# EAGLE design ac (EAGLE 5.08)
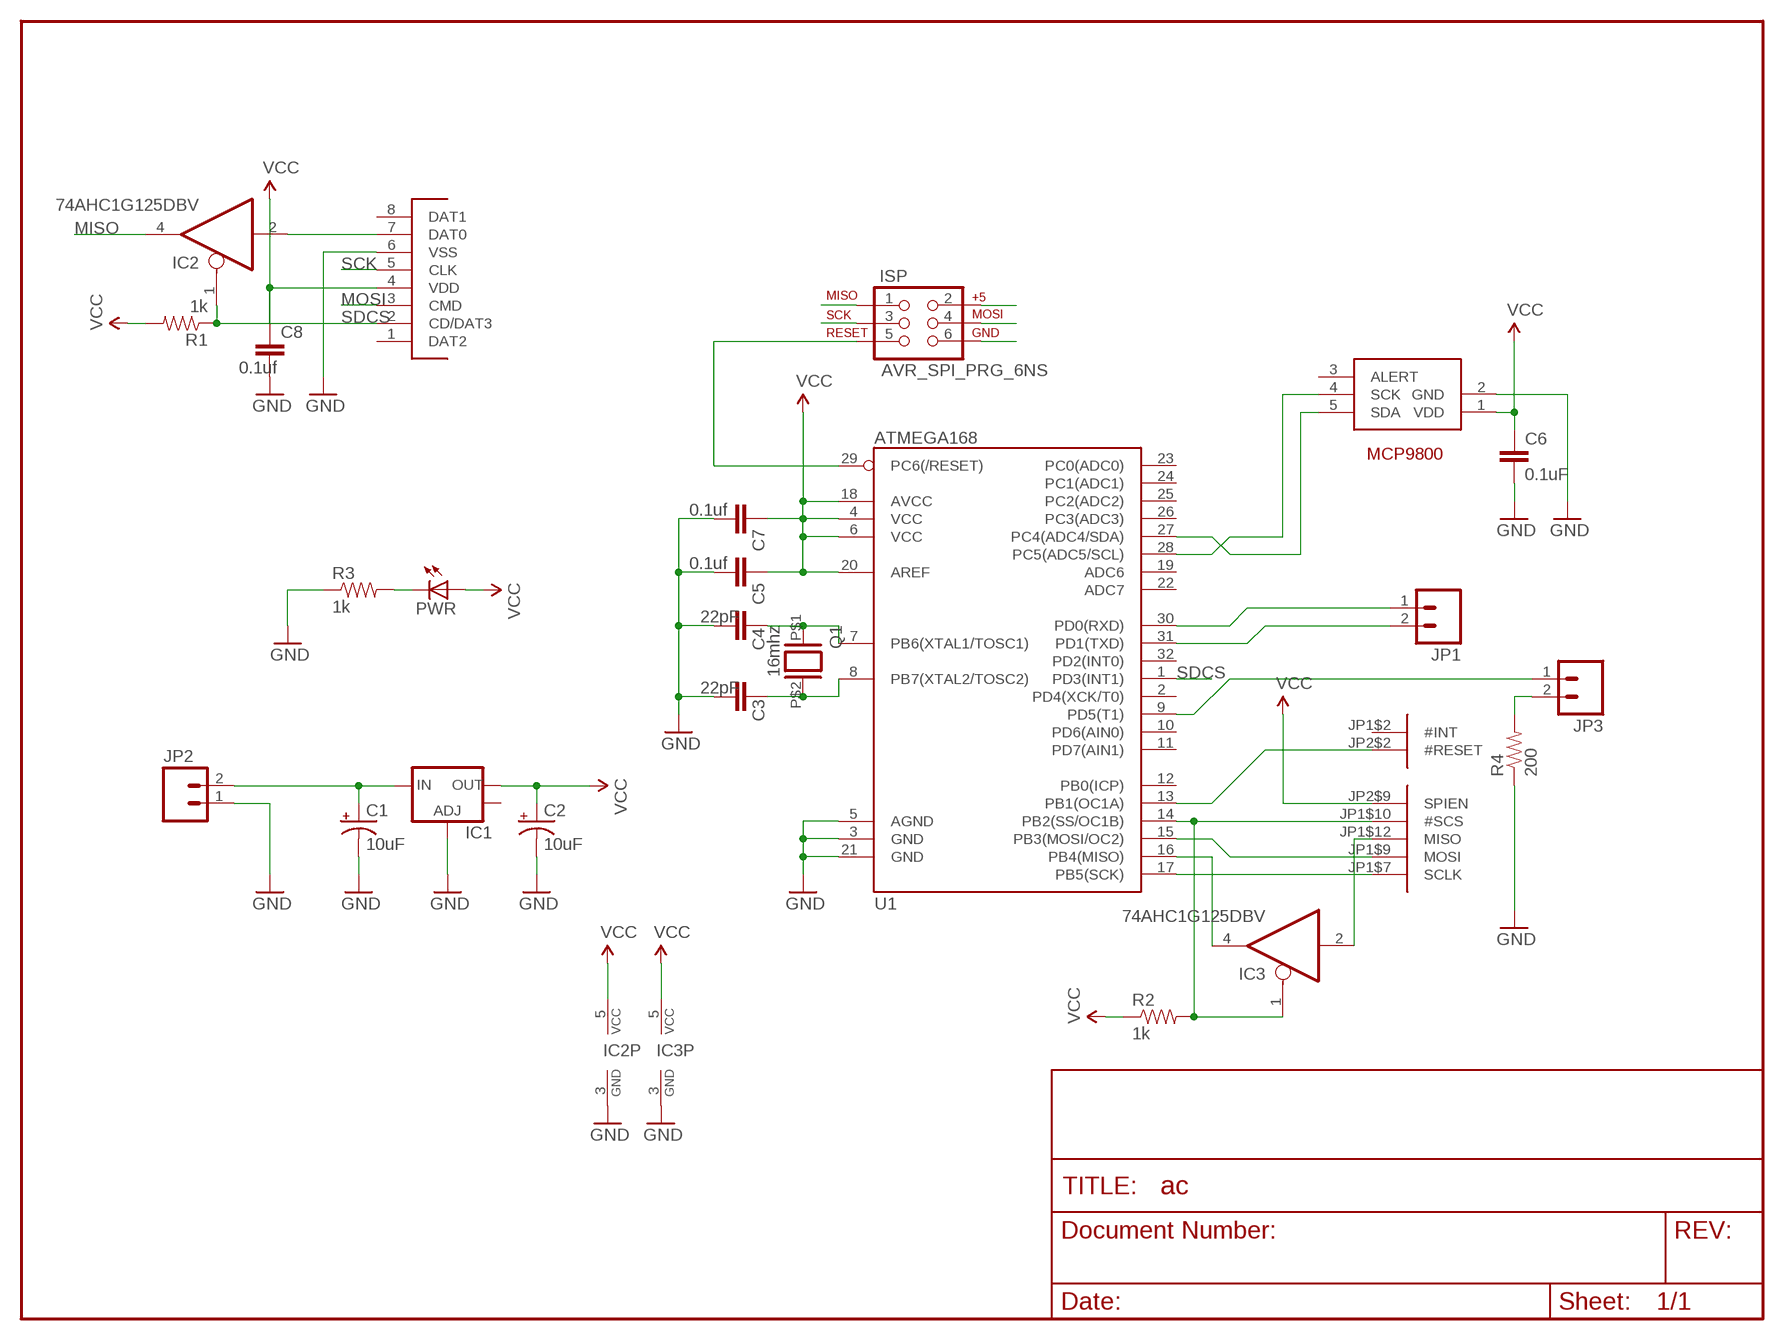
[diagram p0: schematic, sheet 1]

## Parts
C1  10uF  CAP_POL1206  [EIA3216]
C2  10uF  CAP_POL1206  [EIA3216]
C3  22pF  CAP0805  [0805]
C4  22pF  CAP0805  [0805]
C5  0.1uf  CAP0805  [0805]
C6  0.1uF  CAP0805  [0805]
C7  0.1uf  CAP0805  [0805]
C8  0.1uf  CAP0805  [0805]
IC1  V_REG_LM1117SOT223  [SOT223]
IC2  74AHC1G125DBV  [SOT23-5]
IC3  74AHC1G125DBV  [SOT23-5]
ISP  AVR_SPI_PRG_6NS  [2X3-NS]
JP1  M02PTH  [1X02]
JP2  M02PTH  [1X02]
JP3  M02PTH  [1X02]
PWR  LED1206  [LED-1206]
Q1  16mhz  ECX-64A  [ECX-64A]
R1  1k  RESISTOR  [0805]
R2  1k  RESISTOR  [0805]
R3  1k  RESISTOR  [0805]
R4  200  RESISTOR  [0805]
U1  ATMEGA168  [TQFP32-08]
U2  MCP9800  [SOT23-5]
U$1  WIZ810MJ  WIZ810MJSMT  [WIZ810MJ-SMT]
U$2  HRS-DM3D  [HRS-DM3D]

## Nets
+3V3: C2.A(+) C5.1 C6.1 C7.1 C8.1 IC1.2(OUT) IC2.5(VCC) IC3.5(VCC) ISP.2 PWR.A R1.2 R2.1 U1.4(VCC) U1.6(VCC) U1.18(AVCC) U1.20(AREF) U2.1(VDD) U$1.JP2$9(SPIEN) U$2.4(VDD) ; supply symbol labelled VCC
GND: C1.C(-) C2.C(-) C3.1 C4.1 C5.2 C6.2 C7.2 C8.2 IC1.1(ADJ) IC2.3(GND) IC3.3(GND) ISP.6 JP2.1 R3.1 R4.1 U1.3(GND) U1.5(AGND) U1.21(GND) U2.2(GND) U$2.6(VSS)
IR-OUT: JP3.1 U1.9(PD5(T1))
MISO: IC2.4(O) IC3.4(O) ISP.1 U1.16(PB4(MISO))
MOSI: ISP.4 U1.15(PB3(MOSI/OC2)) U$1.JP1$9(MOSI) U$2.3(CMD)
N$1: C1.A(+) IC1.3(IN) JP2.2
N$2: C4.2 Q1.P$1 U1.7(PB6(XTAL1/TOSC1))
N$3: ISP.5 U1.29(PC6(/RESET))
N$4: C3.2 Q1.P$2 U1.8(PB7(XTAL2/TOSC2))
N$5: PWR.C R3.2
N$6: JP3.2 R4.2
N$7: U1.28(PC5(ADC5/SCL)) U2.4(SCK)
N$8: U1.27(PC4(ADC4/SDA)) U2.5(SDA)
N$9: IC2.2(I) U$2.7(DAT0)
N$10: IC3.2(I) U$1.JP1$12(MISO)
RESET: U1.13(PB1(OC1A)) U$1.JP2$2(#RESET)
RX: JP1.1 U1.30(PD0(RXD))
SCK: ISP.3 U1.17(PB5(SCK)) U$1.JP1$7(SCLK) U$2.5(CLK)
SDCS: IC2.1(OE) R1.1 U1.1(PD3(INT1)) U$2.2(CD/DAT3)
TX: JP1.2 U1.31(PD1(TXD))
WIZNET_CS: IC3.1(OE) R2.2 U1.14(PB2(SS/OC1B)) U$1.JP1$10(#SCS)
Unconnected: IC1.4(OUT) U1.2(PD4(XCK/T0)) U1.10(PD6(AIN0)) U1.11(PD7(AIN1)) U1.12(PB0(ICP)) U1.19(ADC6) U1.22(ADC7) U1.23(PC0(ADC0)) U1.24(PC1(ADC1)) U1.25(PC2(ADC2)) U1.26(PC3(ADC3)) U1.32(PD2(INT0)) U2.3(ALERT) U$1.JP1$2(#INT) U$1.JP2$6(#COLLED) U$1.JP2$8(#TXLED) U$1.JP2$10(#RXLED) U$1.JP2$11(#FDXLED) U$1.JP2$12(#LINKLED) U$2.1(DAT2) U$2.8(DAT1)

## Power pins joined to a net without a drawn wire
+3V3: U$1.JP1$1(+3V3) U$1.JP2$24(+3V3)
GND: U$1.JP1$8(GND) U$1.JP1$13(GND) U$1.JP1$24(GND) U$1.JP2$1(GND) U$1.JP2$4(GND) U$1.JP2$7(GND) U$1.JP2$13(GND) U$1.JP2$14(GND) U$1.JP2$23(GND)

## Library data of the parts
C1 C2 = SparkFun:CAP_POL: Capacitor Polarized These are standard SMD and PTH capacitors. Normally 10uF, 47uF, and 100uF in electrolytic and tantalum varieties. Always verify the external diameter of the through hole cap, it varies with capacity, voltage, and manufacturer. The EIA devices should be standard.
C3-C8 = SparkFun:CAP: Capacitor Standard 0603 ceramic capacitor, and 0.1" leaded capacitor.
IC1 = SparkFun:V_REG_LM1117: Voltage Regulator LM1117 Standard adjustable voltage regulator but in SMD form. Spark Fun Electronics SKU : COM-00595
IC2 IC3 = 74xx-little-us:74*1G125: Single Bus Buffer Gate with 3-State Output
ISP = SparkFun:AVR_SPI_PRG_6: AVR ISP 6 Pin This is the reduced ISP connector for AVR programming. Common on Arduino. This footprint will take up less PCB space and can be used with a 10-pin to 6-pin adapter such as SKU: BOB-08508
JP1-JP3 = SparkFun:M02: Header 2 Standard 2-pin 0.1" header. Use with straight break away headers (SKU : PRT-00116), right angle break away headers (PRT-00553), swiss pins (PRT-00743), machine pins (PRT-00117), and female headers (PRT-00115). Molex polarized connector foot print use with SKU : PRT-08233 with associated crimp pins and housings.
PWR = SparkFun:LED: LEDs Standard schematic elements and footprints for 5mm, 3mm, 1206, and 0603 sized LEDs. 5mm - Spark Fun Electronics SKU : COM-00529 (and others)
Q1 = ac:ECX-64A
R1-R4 = SparkFun:RESISTOR: Resistor Basic schematic elements and footprints for 0603, 1206, and PTH 1/10th watt (small) resistors.
U1 = SparkFun:ATMEGA168
U2 = ac:MCP9800: MCP8500 Digital temperature sensors converts temperatures between -55°C and +125°C to a digital word. They provide an accuracy of ±1°C (max.) from -10°C to +85°C.
U$1 = ac:WIZ810MJ: WIZ810MJ (W5100) WIZ810MJ is a network module that includes the W5100 (TCP/IP hardwired chip, include PHY), MAG-JACK (RJ45 with X?FMR) with other glue logics. It can be used as a component and no effort is required to interface W5100 and Transformer.
U$2 = ac:HRS-DM3D

## Board
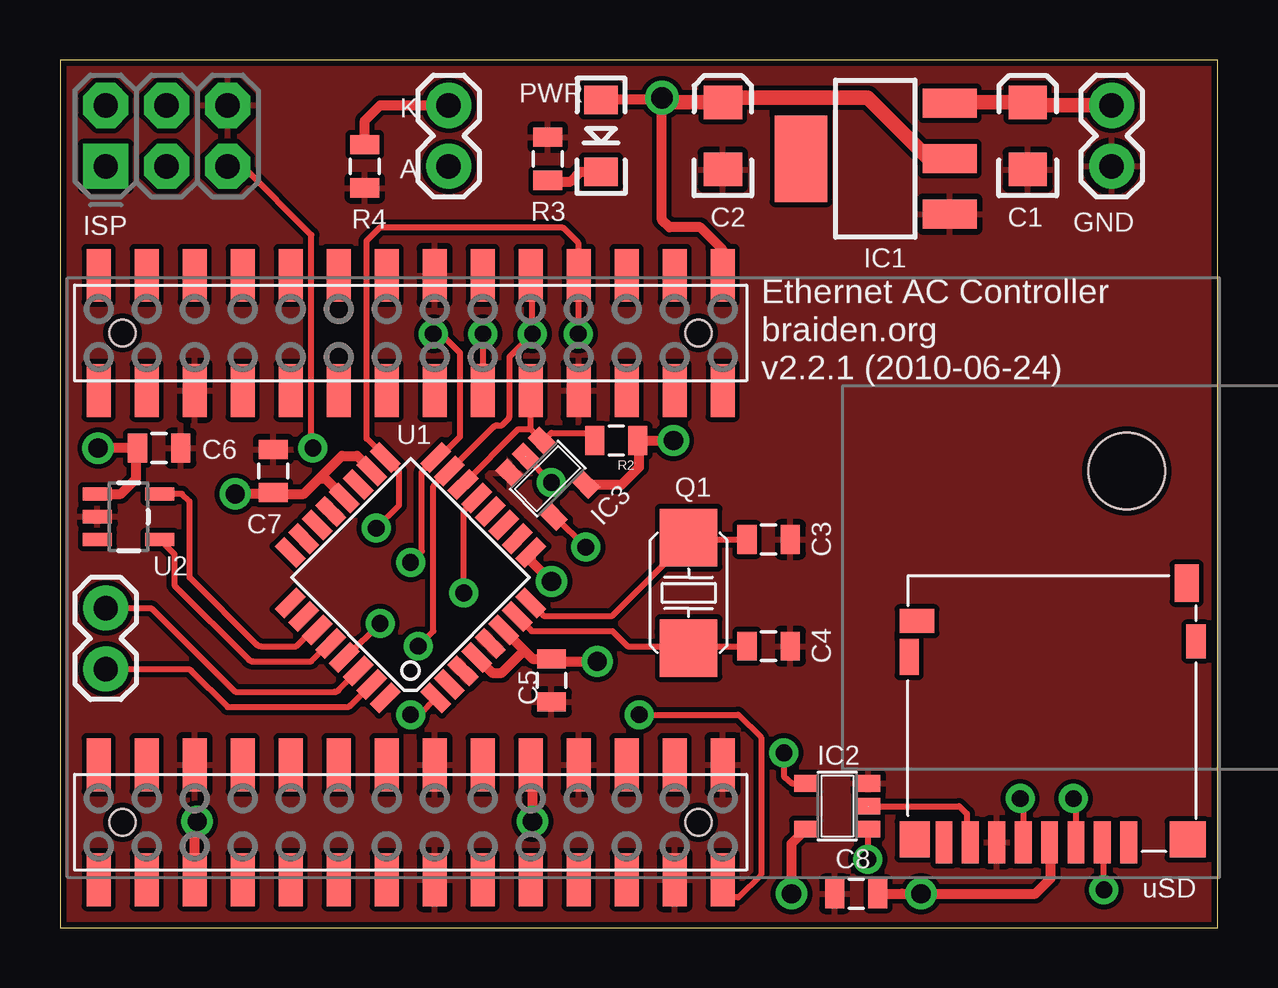
[diagram p1: board, top side]
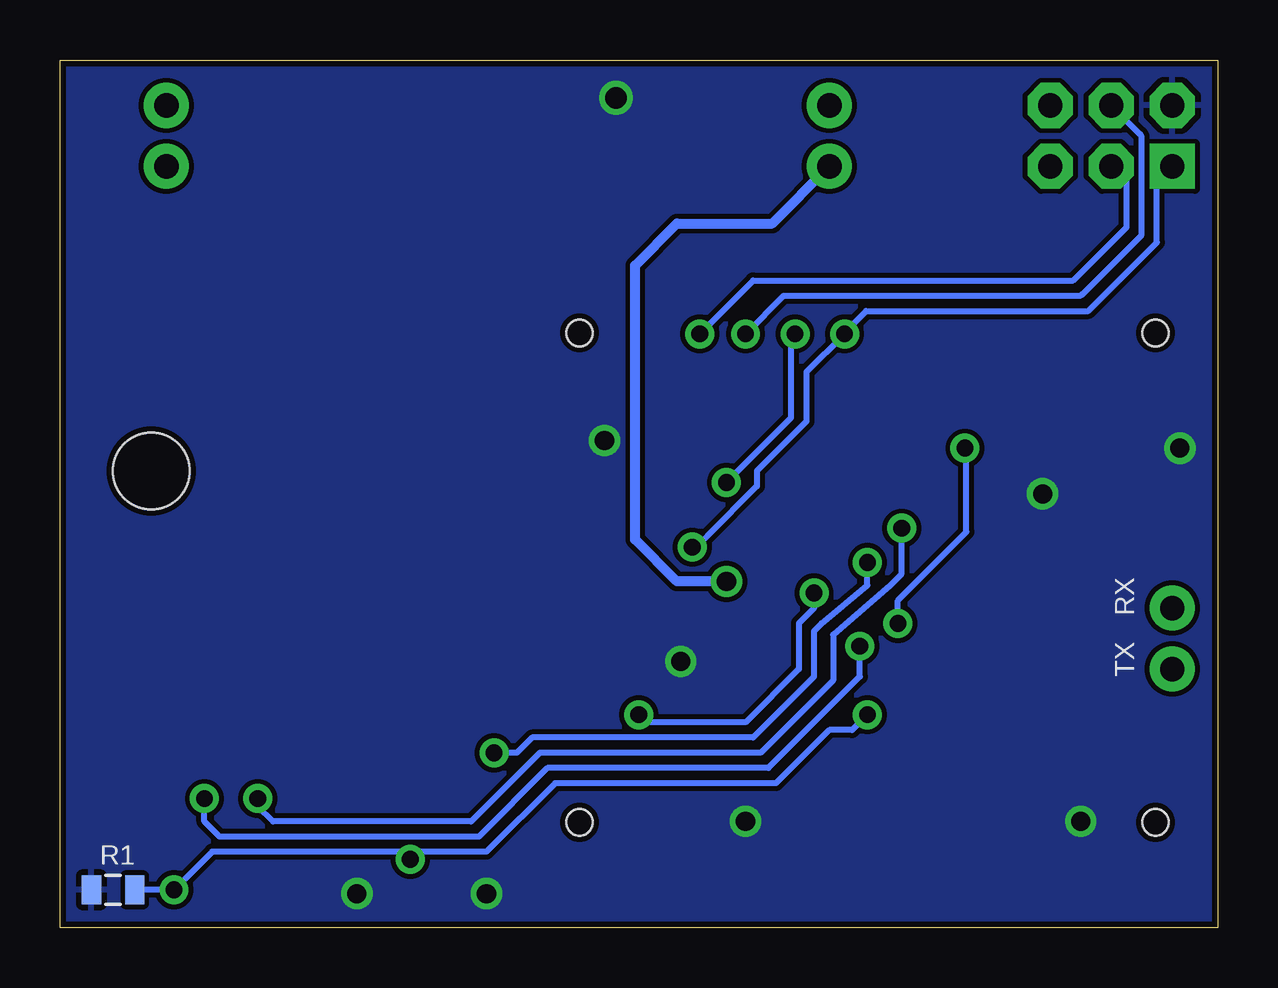
[diagram p2: board, bottom side, seen from below]

Size 48.25 x 36.19 mm. Coordinates in mm from the lower left corner, seen from the top.
Outline: 0,0 48.25,0 48.25,36.19 0,36.19 0,0
Copper layers (1*16): Top 0.035mm / dielectric 1.5mm / Bottom 0.035mm
Design rules "batchpbc": minimum track width 8mil, minimum drill 20mil, track to track 8mil, track to pad 8mil, pad to pad 8mil, via to via 8mil, smd to smd 8mil, copper to edge 10mil, drill to drill 8mil, minimum pad ring 12mil, minimum via ring 10mil, stop-mask expansion 4mil, vias tented up to drill 25mil, thermal gap 10mil
Holes 3.2 mm at 44.45,19.05

### Footprints (pad centres in the part's own frame; a part is rotated, then mirrored left to right if it is on the bottom)
EIA3216 = smd 1.4 x 1.6: A 1.4,0; C -1.4,0
0805 = smd 0.8 x 1.2: 1 -0.9,0; 2 0.9,0
SOT223 = smd 1.219 x 2.235: 1 -2.311,-3.099; 2 0,-3.099; 3 2.311,-3.099 | smd 3.6 x 2.2: 4 0,3.099
SOT23-5 = smd 0.69 x 0.99: 1 -0.95,-1.29; 2 0,-1.29; 3 0.95,-1.29; 4 0.95,1.3; 5 -0.95,1.3
2X3-NS = drill 1.016 pad 1.88 square: 1 -2.54,-1.27 | drill 1.016 pad 1.88 octagon: 2 -2.54,1.27; 3 0,-1.27; 4 0,1.27; 5 2.54,-1.27; 6 2.54,1.27
1X02 = drill 1.016 pad 1.88 round: 1 0,0; 2 2.54,0
LED-1206 = smd 1.2 x 1.4: A -1.5,0; C 1.5,0
ECX-64A = smd 2.4 x 2.4: P$1 -2.3,0; P$2 2.3,0
TQFP32-08 = smd 1.27 x 0.559: 1 -4.293,2.8; 2 -4.293,2; 3 -4.293,1.2; 4 -4.293,0.4; 5 -4.293,-0.4; 6 -4.293,-1.2; 7 -4.293,-2; 8 -4.293,-2.8; 17 4.293,-2.8; 18 4.293,-2; 19 4.293,-1.2; 20 4.293,-0.4; 21 4.293,0.4; 22 4.293,1.2; 23 4.293,2; 24 4.293,2.8 | smd 0.559 x 1.27: 9 -2.8,-4.293; 10 -2,-4.293; 11 -1.2,-4.293; 12 -0.4,-4.293; 13 0.4,-4.293; 14 1.2,-4.293; 15 2,-4.293; 16 2.8,-4.293; 25 2.8,4.293; 26 2,4.293; 27 1.2,4.293; 28 0.4,4.293; 29 -0.4,4.293; 30 -1.2,4.293; 31 -2,4.293; 32 -2.8,4.293
SOT23-5' = smd 0.55 x 1.2: 1 -0.95,-1.3; 2 0,-1.3; 3 0.95,-1.3; 4 0.95,1.3; 5 -0.95,1.3
WIZ810MJ-SMT = smd 1 x 2.2: JP1$1 13,12.6; JP1$2 13,7.8; JP1$3 11,12.6; JP1$4 11,7.8; JP1$5 9,12.6; JP1$6 9,7.8; JP1$7 7,12.6; JP1$8 7,7.8; JP1$9 5,12.6; JP1$10 5,7.8; JP1$11 3,12.6; JP1$12 3,7.8; JP1$13 1,12.6; JP1$14 1,7.8; JP1$15 -1,12.6; JP1$16 -1,7.8; JP1$17 -3,12.6; JP1$18 -3,7.8; JP1$19 -5,12.6; JP1$20 -5,7.8; JP1$21 -7,12.6; JP1$22 -7,7.8; JP1$23 -9,12.6; JP1$24 -9,7.8; JP1$25 -11,12.6; JP1$26 -11,7.8; JP1$27 -13,12.6; JP1$28 -13,7.8; JP2$1 13,-7.8; JP2$2 13,-12.6; JP2$3 11,-7.8; JP2$4 11,-12.6; JP2$5 9,-7.8; JP2$6 9,-12.6; JP2$7 7,-7.8; JP2$8 7,-12.6; JP2$9 5,-7.8; JP2$10 5,-12.6; JP2$11 3,-7.8; JP2$12 3,-12.6; JP2$13 1,-7.8; JP2$14 1,-12.6; JP2$15 -1,-7.8; JP2$16 -1,-12.6; JP2$17 -3,-7.8; JP2$18 -3,-12.6; JP2$19 -5,-7.8; JP2$20 -5,-12.6; JP2$21 -7,-7.8; JP2$22 -7,-12.6; JP2$23 -9,-7.8; JP2$24 -9,-12.6; JP2$25 -11,-7.8; JP2$26 -11,-12.6; JP2$27 -13,-7.8; JP2$28 -13,-12.6 | hole 1.1: 12,10.2; -12,10.2; 12,-10.2; -12,-10.2
HRS-DM3D = smd 0.7 x 1.75: 1 7.7,-0.875; 2 6.6,-0.875; 3 5.5,-0.875; 4 4.4,-0.875; 5 3.3,-0.875; 6 2.2,-0.875; 7 1.1,-0.875; 8 0,-0.875 | smd 0.8 x 1.5: P$1 -1.45,6.85 | smd 1.45 x 1: P$2 -1.125,8.35 | smd 0.8 x 1.4: P$3 10.5,7.5 | smd 1 x 1.55: P$4 10.11,9.925 | smd 1.25 x 1.5: P$9 -1.225,-0.75 | smd 1.5 x 1.5: P$10 10.15,-0.75

### Placement (x,y rotation side)
C1  40.32,33.02 90 top
C2  27.62,33.02 90 top
C3  29.53,16.19 180 top
C4  29.53,11.75 180 top
C5  20.48,10.32 270 top
C6  4.13,20 0 top
C7  8.89,19.05 90 top
C8  33.18,1.43 180 top
IC1  33.97,32.07 90 top
IC2  32.38,5.08 90 top
IC3  20.32,18.73 225 top
ISP  4.45,33.02 0 top
JP1  1.9,13.34 270 top
JP2  43.81,31.75 90 top
JP3  16.19,31.75 90 top
PWR  22.54,33.02 270 top
Q1  26.19,13.97 90 top
R1  46.04,1.59 180 bottom
R2  23.18,20.32 180 top
R3  20.32,32.07 270 top
R4  12.7,31.75 90 top
U1  14.61,14.6 135 top
U2  MCP9800  [SOT23-5']  2.86,17.14 270 top
U$1  14.61,14.6 0 top
U$2  36.83,4.45 0 top

### Tracks (layer width: path | path; a pad name or v marks a point on that pad's centre or on a via)
+3V3  (via drill 0.8, 0.9)
  Top 0.254: 3.18,20 C6.1 | U$1.JP2$9 19.69,6.8
  Top 0.406: 17.24,11.34 arc45 U1.4 18.01,10.64 18.41,10.64 19.26,11.48 19.42,11.48 | v5.71,4.45 5.68,4.41 arc45 5.61,4.23 U$1.JP2$24 | 11.97,17.87 arc45 U1.20 11.04,18.73 10.79,18.73 | 3.17,20 arc45 3.18,20 | PWR.A 24.99,34.52 v25.08,34.61 25.08,29.53 25.4,29.21 26.67,29.21 27.6,28.27 U$1.JP1$1 | 8.89,18.1 v7.3,18.1 | C7.1 8.89,18.1 | 8.89,18.1 10.16,18.1 10.79,18.73 | U1.18 12.98,19.08 12.38,19.69 11.75,19.69 10.79,18.73 | v22.38,11.11 20.27,11.11 C5.1 19.69,11.22 19.42,11.48 | 19.42,11.48 U1.6 | 3.17,20 v1.59,20 | U2.1 2.54,18.09 3.18,18.73 3.18,19.99 3.17,20 | C8.1 35.08,1.43 v35.88,1.43 40.64,1.43 41.27,2.06 41.27,3.52 U$2.4 | 19.69,6.8 v19.69,4.45 | v30.48,1.43 30.48,3.52 IC2.5 | IC3.5 23.41,18.48 24.13,19.21 24.13,20.27 R2.1 v25.56,20.32 | v25.56,20.32
  Top 0.61: IC1.2 36.2,32.07 33.66,34.61 27.81,34.61 C2.A 25.27,34.42 v25.08,34.61
  pour Bottom: 0,36.19 48.26,36.19 48.26,0 0,0
GND
  pour Top: 0,36.19 48.26,36.19 48.26,0 0,0
IR-OUT  (via drill 0.8)
  Top 0.406: U1.9 19.62,15.3 v20.48,14.45
  Bottom 0.406: v20.48,14.45 22.54,14.45 24.29,16.19 24.29,27.62 22.54,29.37 18.57,29.37 JP3.1
MISO  (via drill 0.7)
  Top 0.254: v14.61,15.24 15.08,15.71 15.08,19.04 U1.16 15.7,19.62 arc45 15.88,19.7 16.67,20.48 16.67,23.97 15.88,24.77 v15.56,24.77 | v30.16,7.3 30.16,6.32 30.48,6.03 30.8,6.03 IC2.4 | IC3.4 20.64,17.14 v21.91,15.88
  Bottom 0.254: ISP.1 2.22,31.75 2.54,31.43 2.54,28.57 5.4,25.72 14.66,25.72 15.56,24.82 v15.56,24.77 17.14,23.18 17.14,21.11 19.21,19.05 19.21,18.41 21.27,16.35 21.75,15.88 v21.91,15.88 | v14.61,15.24 14.61,14.29 16.51,12.7 16.83,12.38 16.83,10.48 19.37,7.94 28.57,7.94 29.21,7.3 v30.16,7.3
MOSI  (via drill 0.7)
  Top 0.254: 19.69,27.02 arc45 U$1.JP1$9 19.69,27.12 v19.69,24.77 18.73,23.81 18.73,21.38 arc-45 18.66,21.2 18.41,20.95 18.23,20.95 arc45 18.05,20.88 U1.15 16.2,19.05 15.56,18.41 15.56,12.38 v14.92,11.75 | U$2.3 42.33,5.3 v42.23,5.4
  Bottom 0.254: 3.18,32.91 arc-45 3.25,33.09 | 3.18,32.91 3.18,28.89 5.64,26.43 arc45 5.82,26.35 18.1,26.35 v19.69,24.77 | 3.18,32.91 arc-45 3.25,33.09 | 3.25,33.09 ISP.4 | v42.23,5.4 42.23,4.45 41.59,3.81 30.8,3.81 27.94,6.67 18.73,6.67 14.92,10.48 v14.92,11.75
N$1
  Top 0.61: JP2.2 40.32,34.29 C1.A 37.07,34.42 IC1.3
N$2
  Top 0.254: U1.7 19.66,12.38 23.02,12.38 23.65,11.75 25.4,11.75 25.11,12.35 Q1.P$1 25.74,11.75 C4.2
N$3  (via drill 0.7)
  Top 0.254: U1.29 arc45 11.97,11.34 v13.34,12.7 | v10.54,20 10.48,20.07 10.48,28.89 7.62,31.75 ISP.5
  Bottom 0.254: v10.54,20 10.48,19.94 10.48,16.51 13.34,13.65 v13.34,12.7
N$4
  Top 0.254: U1.8 20.15,13.02 23.02,13.02 25.11,15.11 Q1.P$2 25.74,16.19 C3.2
N$5
  Top 0.406: PWR.C 21.68,31.52 21.27,31.11 20.37,31.11 R3.2
N$6
  Top 0.406: R4.2 12.7,33.66 13.34,34.29 JP3.2
N$7
  Top 0.254: U1.28 arc45 11.17,11.8 10.48,11.11 8.04,11.11 arc-45 7.86,11.19 4.76,14.29 4.76,15.59 U2.4
N$8
  Top 0.254: U1.27 10.62,12.42 arc45 10.44,12.34 9.84,11.75 8.36,11.75 arc-45 8.18,11.82 5.4,14.6 5.4,17.78 5.08,18.1 U2.5
N$9
  Top 0.254: IC2.2 37.46,5.08 37.78,4.76 37.78,3.72 U$2.7
N$10  (via drill 0.7)
  Top 0.254: U$1.JP1$12 17.62,22.42 v17.62,24.77 | v20.48,18.57 | IC3.2 v20.48,18.57
  Bottom 0.254: v17.62,24.77 17.78,24.61 17.78,23.97 17.78,21.27 v20.48,18.57
RESET  (via drill 0.7)
  Top 0.254: U1.13 16.83,17.39 v16.83,13.97 | v24.13,8.89 28.26,8.89 29.21,7.94 29.21,2.22 28.26,1.27 27.62,1.27 27.62,1.99 U$1.JP2$2
  Bottom 0.254: v16.83,13.97 16.83,13.34 17.46,12.7 17.46,10.8 19.69,8.57 23.81,8.57 v24.13,8.89
RX
  Top 0.254: U1.30 11.61,9.92 arc-45 11.43,9.84 7.3,9.84 3.88,13.26 arc45 3.7,13.34 JP1.1
SCK  (via drill 0.7)
  Top 0.254: U1.17 13.55,19.68 arc45 13.47,19.86 | U1.17 12.77,20.39 12.77,28.65 13.34,29.21 20.85,29.21 arc-45 21.03,29.14 21.59,28.57 21.59,27.24 arc45 U$1.JP1$7 21.59,27.19 v21.59,24.77 | U$2.5 40.13,5.27 v40.01,5.4 | v13.18,16.67 14.13,17.62 14.13,19.04 U1.17
  Bottom 0.254: ISP.3 4.13,31.75 3.81,31.43 3.81,29.21 6.03,26.99 19.37,26.99 v21.59,24.77 | v40.01,5.4 40.01,5.08 39.37,4.45 31.12,4.45 28.26,7.3 19.05,7.3 16.04,10.32 16.04,12.22 13.65,14.29 13.18,14.76 v13.18,16.67
SDCS  (via drill 0.7)
  Top 0.254: U$2.2 43.5,3.5 v43.5,1.59 | v14.61,8.89 14.96,8.89 U1.1 | IC2.1 33.67,2.88 v33.66,2.86
  Bottom 0.254: 33.97,3.17 30.48,3.17 27.62,6.03 18.41,6.03 16.19,8.25 15.24,8.25 v14.61,8.89 | 33.97,3.17 41.91,3.17 v43.5,1.59 R1.1 | 33.97,3.17 v33.66,2.86
TX
  Top 0.254: U1.31 12.11,9.28 arc-45 11.93,9.21 6.98,9.21 5.47,10.72 arc45 5.29,10.8 JP1.2
WIZNET_CS
  Top 0.254: 19.6,21.41 U$1.JP1$10 19.6,20.79 | 19.6,20.79 IC3.1 20.16,20.32 20.48,20.64 21.96,20.64 R2.2 | U1.14 19.09,20.79 19.6,20.79

### Text on the board
tPlace: K | A | GND | Ethernet AC Controller | braiden.org | v2.2.1 (2010-06-24)
bPlace: RX | TX
tNames: uSD